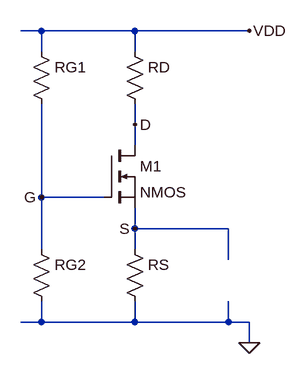
[diagram p0: schematic nmos_DC.asc]
nmos_DC.asc, the LTspice schematic file:
Version 4
SHEET 1 880 680
WIRE 368 -144 336 -144
WIRE 512 -144 368 -144
WIRE 688 -144 512 -144
WIRE 368 -112 368 -144
WIRE 512 -112 512 -144
WIRE 512 0 512 -32
WIRE 512 32 512 0
WIRE 368 112 368 -32
WIRE 464 112 368 112
WIRE 512 160 512 128
WIRE 656 160 512 160
WIRE 368 192 368 112
WIRE 512 192 512 160
WIRE 656 208 656 160
WIRE 368 304 368 272
WIRE 368 304 336 304
WIRE 512 304 512 272
WIRE 512 304 368 304
WIRE 656 304 656 272
WIRE 656 304 512 304
WIRE 688 304 656 304
WIRE 688 336 688 304
FLAG 688 -144 VDD
FLAG 688 336 0
FLAG 368 112 G
FLAG 512 0 D
FLAG 512 160 S
SYMBOL res 352 176 R0
WINDOW 3 36 76 Invisible 2
SYMATTR InstName RG2
SYMBOL res 352 -128 R0
WINDOW 3 36 76 Invisible 2
SYMATTR InstName RG1
SYMBOL nmos 464 32 R0
SYMATTR InstName M1
SYMBOL res 496 -128 R0
WINDOW 3 36 76 Invisible 2
SYMATTR InstName RD
SYMBOL res 496 176 R0
WINDOW 3 36 76 Invisible 2
SYMATTR InstName RS

The netlist it stands for:
* nmos_DC.asc
RG2 G 0 R
RG1 VDD G R
M1 D G S S NMOS
RD VDD D R
RS S 0 R
.model NMOS NMOS
.model PMOS PMOS
.lib standard.mos
.backanno
.end